# Altium schematic sheet Power_Neg.SchDoc
size A4; CompanyName: Technische Hochschule Nürnberg Georg Simon Ohm; Organization: UltraZohm; Address1: Kesslerplatz 12; Address2: 90489 Nürnberg; Address3: GERMANY; Website: www.ultrazohm.com
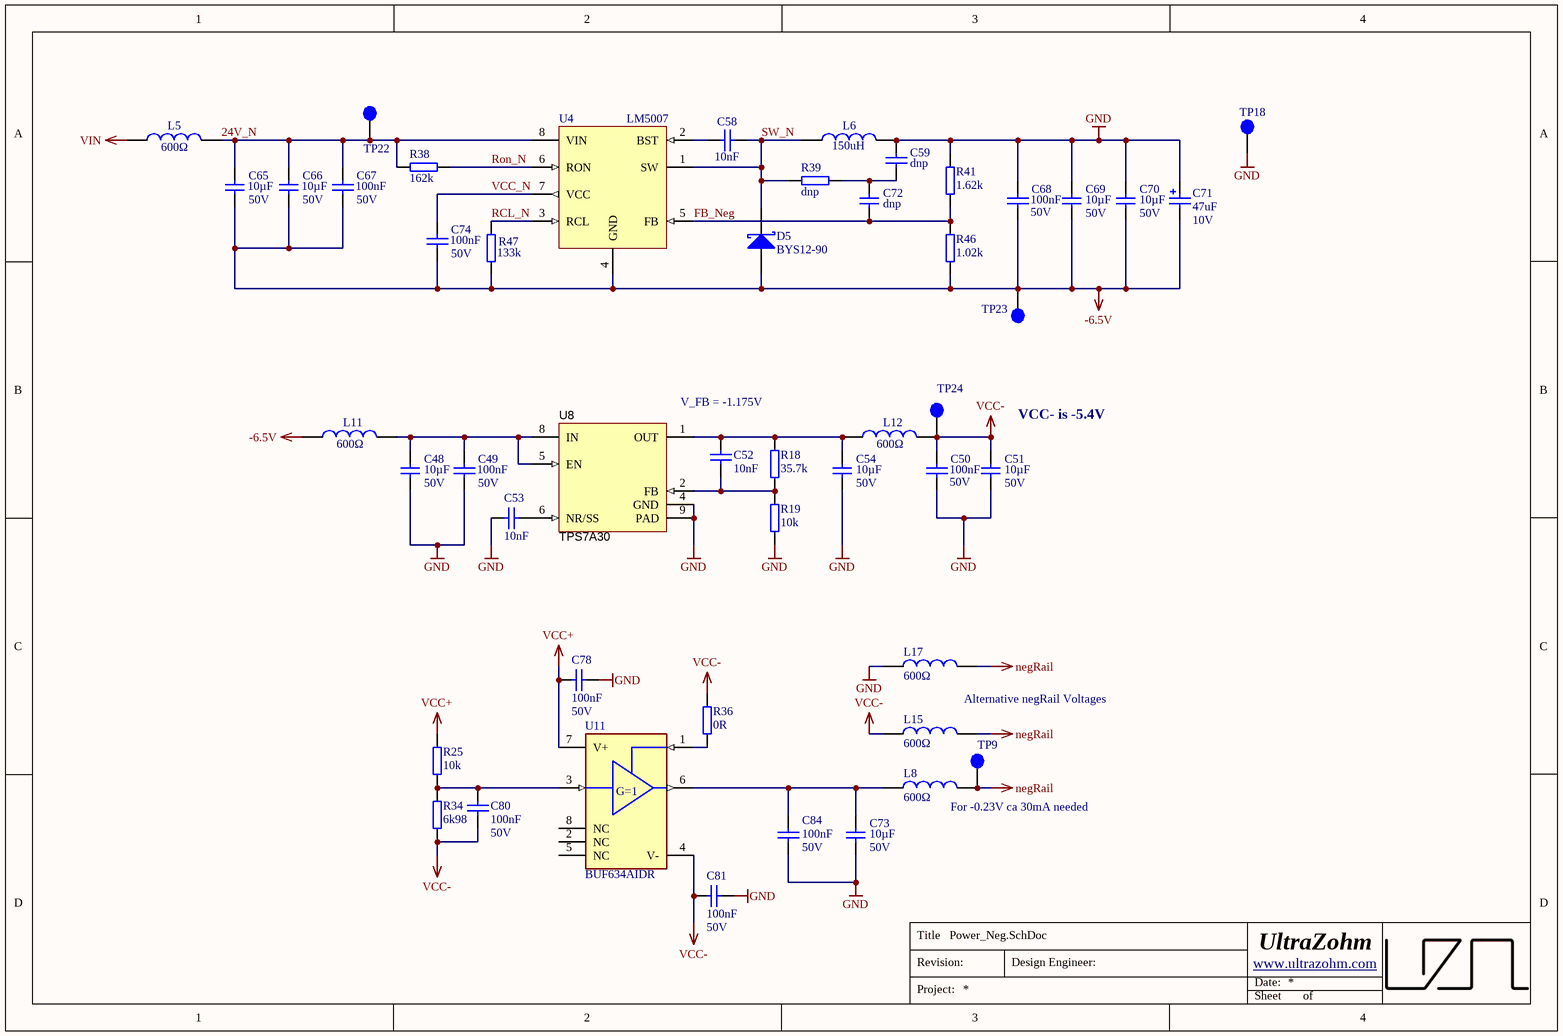
[diagram p0: Power_Neg.SchDoc]

## Parts
C48  10µF  Voltage: 50V  [C_1206]
C49  100nF  Voltage: 50V  [CAPC1608X07N]
C50  100nF  Voltage: 50V  [CAPC1608X07N]
C51  10µF  Voltage: 50V  [C_1206]
C52  10nF  [CAPC1608X07N]
C53  10nF  [CAPC1608X07N]
C54  10µF  Voltage: 50V  [C_1206]
C58  10nF  [CAPC1608X07N]
C59  dnp  [CAPC1608X07N]
C65  10µF  Voltage: 50V  [C_1206]
C66  10µF  Voltage: 50V  [C_1206]
C67  100nF  Voltage: 50V  [CAPC1608X07N]
C68  100nF  Voltage: 50V  [CAPC1608X07N]
C69  10µF  Voltage: 50V  [C_1206]
C70  10µF  Voltage: 50V  [C_1206]
C71  47uF  Voltage: 10V  [WCAP-ASLI_5x5.5]
C72  dnp  [C_1206]
C73  10µF  Voltage: 50V  [C_1206]
C74  100nF  Voltage: 50V  [CAPC1608X07N]
C78  100nF  Voltage: 50V  [CAPC1608X07N]
C80  100nF  Voltage: 50V  [CAPC1608X07N]
C81  100nF  Voltage: 50V  [CAPC1608X07N]
C84  100nF  Voltage: 50V  [CAPC1608X07N]
D5  BYS12-90  [DIOM4227X23N]
L5  600Ω  [WE-CBF_0805_High Current]
L6  150uH  [SMT_inductor_1050_Performance]
L8  600Ω  [WE-CBF_0805_High Current]
L11  600Ω  [WE-CBF_0805_High Current]
L12  600Ω  [WE-CBF_0805_High Current]
L15  600Ω  [WE-CBF_0805_High Current]
L17  600Ω  [WE-CBF_0805_High Current]
R18  35.7k  [RESC1608X06N]
R19  10k  [RESC1608X06N]
R25  10k  [RESC1608X06N]
R34  6k98  [RESC1608X06N]
R36  0R  [RESC1608X06N]
R38  162k  [RESC1608X06N]
R39  dnp  [RESC1608X06N]
R41  1.62k  [RESC1608X06N]
R46  1.02k  [RESC1608X06N]
R47  133k  [RESC1608X06N]
TP9  negRail  [TP_1mm]  (value not drawn)  (no BOM)
TP18  GND  [TP_1mm]  (value not drawn)  (no BOM)
TP22  VIN  [TP_1mm]  (value not drawn)  (no BOM)
TP23  -6.5V  [TP_1mm]  (value not drawn)  (no BOM)
TP24  VCC-  [TP_1mm]  (value not drawn)  (no BOM)
U4  LM5007  [TSOP65P490X110-8N]
U8  TPS7A30  [DGN0008D_N]
U11  BUF634AIDR  [FP-BUF634AIDR-MFG]

## Nets
-6.5V: C65.1 C66.1 C67.2 C68.1 C69.1 C70.1 C71.1(N) C74.2 D5.2(A) L11.1 R46.2 R47.1 TP23.1 U4.4(GND)
GND: C48.1 C49.2 C50.1 C51.1 C53.2 C54.1 C59.1 C68.2 C69.2 C70.2 C71.2(P) C73.1 C78.1 C81.1 C84.1 L6.2 L17.1 R19.2 R41.1 TP18.1 U8.4(GND) U8.9(PAD)
negRail: L8.2 L15.2 L17.2 TP9.1
VCC+: C78.2 R25.2 U11.7(V+)
VCC-: C50.2 C51.2 C80.2 C81.2 L12.2 L15.1 R34.1 R36.2 TP24.1 U11.4(V-)
VIN: L5.1
24V_N: C65.2 C66.2 C67.1 L5.2 R38.2 TP22.1 U4.8(VIN)
FB_Neg: C72.2 R41.2 R46.1 U4.5(FB)
RCL_N: R47.2 U4.3(RCL)
Ron_N: R38.1 U4.6(RON)
SW_N: C58.1 D5.1(K) L6.1 R39.2 U4.1(SW)
VCC_N: C74.1 U4.7(VCC)
NetC48_2: C48.2 C49.1 L11.2 U8.5(EN) U8.8(IN)
NetC52_1: C52.1 C54.2 L12.1 R18.1 U8.1(OUT)
NetC52_2: C52.2 R18.2 R19.1 U8.2(FB)
NetC53_1: C53.1 U8.6(NR/SS)
NetC58_2: C58.2 U4.2(BST)
NetC59_2: C59.2 C72.1 R39.1
NetC73_2: C73.2 C84.2 L8.1 U11.6(VO)
NetC80_1: C80.1 R25.1 R34.2 U11.3(VIN)
NetR36_1: R36.1 U11.1(BW)

Not connected (* = marked no-connect by the designer): U8 3(NC) 7(DNC); U11 2(NC) 5(NC) 8(NC)

## Notes on the sheet
- V_FB = -1.175V
- (near C51) VCC- is -5.4V
- Alternative negRail Voltages
- (near L8) For -0.23V ca 30mA needed
- Title
- Revision:
- Design Engineer:
- Date:
- Project:
- Sheet
- of
- (in symbol BUF634A) G=1

## Library data of the parts
C48 C51 C54 C69 C70 C73 = C_1206: Capacitor 1206; MPN: CL31A106MBHNNNE; Tolerance: 10%; MF: Samsung; Dielectric: X5R; Package: 1206; Value: 10µF; Created: 2020_09_17_Liegmann; Supplier 1: Mouser; Supplier Part Number 1: 187-CL31A106MBHNNNE
C49 C50 C67 C68 C74 = Cap_0603: MPN: CC0603KRX7R9BB104; MF: Yageo; Tolerance: 10%; Dielectric: X5R; Value: 100nF; Supplier 1: Mouser; Supplier 2: Mouser; Supplier Part Number 1: 603-CC603KRX7R9BB104; Supplier Part Number 2: 710-885382206004; Package: 0603
C52 C53 C58 = Cap_0603: MPN: 885012206065; MF: Würth Elektronik; Voltage: 25V; Dielectric: X7R; Value: 10nF; Supplier 1: Mouser; Supplier 2: Digi-Key; Supplier Part Number 1: 710-885012206065; Supplier Part Number 2: 732-7983-1-ND; Package: 0603
C59 = Cap_0603: MPN: C0603C752J3GACTU; possibleValue: 7.5nF; MF: KEMET; Voltage: 25V; Dielectric: C0G; Tolerance: 5%; Supplier 1: Mouser; Supplier 2: *; Supplier Part Number 1: 80-C0603C752J3GACTU; Supplier Part Number 2: *; Package: 0603; Value: dnp
C65 C66 = C_1206: Capacitor 1206; MPN: CL31A106MBHNNNE; Tolerance: 20%; MF: Samsung; Dielectric: X5R; Package: 1206; Value: 10µF; Supplier 1: Mouser; Supplier Part Number 1: 187-CL31A106MBHNNNE
C71 = 865080142007: WCAP-ASLI Aluminum Electrolytic Capacitor, V-Chip, SMT, D5xH5.5mm, 47uF, 10V; MPN: 865080242004; Dissipation Factor: 24%; Endurance: 2000h; Leakage Current: 6.3uA; MF: Wurth Elektronik; Ripple Current: 170mA; Capacitance Tolerance: +/-20%; Technical Reference: ASEC055101M6R3DVCTBB000; ComponentLink1Description: Manufacturer; ComponentLink1URL: http://www.we-online.de; ComponentLink2Description: Datasheet; ComponentLink2URL: https://www.we-online.com/catalog/datasheet/865080142007.pdf; Height: 5.5mm; Mounting Technology: SMT; Operating Temperature: -55 to +105degC; Packaging: Tape and Reel; Published Date: May 2020; Diameter: 5mm; Supplier 1: Mouser; Supplier Part Number 1: 710-865080242004; Value: 47uF
C72 = C_1206: Capacitor 1206; MPN: GRM3195C1H273JA01D; possibleValue: 0.027µF; Tolerance: 5%; MF: Murata Electronics; Dielectric: C0G; Voltage: 50V; Package: 1206; Supplier 1: Mouser; Supplier Part Number 1: 81-GRM315C1H273JA01D; Value: dnp
C78 C80 C81 C84 = Cap_0603: MPN: CC0603KRX7R9BB104; MF: Yageo; Dielectric: X5R; Value: 100nF; Supplier 1: Mouser; Supplier 2: Mouser; Supplier Part Number 1: 603-CC603KRX7R9BB104; Supplier Part Number 2: 710-885382206004; Package: 0603
D5 = BYS12-90: Schottky Diode; MPN: BYS12-90-E3/TR3; MF: Vishay; Forward Voltage: 750mV; Reverse Voltage: 90V; Rated Current: 1.5A; Package: DO-214AC; Supplier 1: Farnell; Supplier 2: Mouser; Supplier 3: Digi-Key; Supplier Part Number 1: 2889144; Supplier Part Number 2: 625-BYS12-90-E3/TR3; Supplier Part Number 3: BYS12-90-E3/GICT-ND; ComponentLink1Description: Manufacturer; ComponentLink1URL: https://www.vishay.com/; ComponentLink2Description: Datasheet; ComponentLink2URL: https://www.vishay.com/docs/88950/bys12-90.pdf
L5 L11 L12 = WE-CBF, 742792040: WE-CBF SMD EMI Suppression Ferrite Bead, 0805, 600Ω; MF: Würth Elektronik; Type: High Current; ComponentLink1Description: Manufacturer; ComponentLink1URL: http://www.we-online.de; ComponentLink2Description: Datasheet; ComponentLink2URL: http://katalog.we-online.de/pbs/datasheet/742792040.pdf; MPN: 742792040; Value: 600Ω; Size: 0805; Supplier 1: Farnell; Supplier 2: Mouser; Supplier 3: Digi-Key; Supplier Part Number 1: 1635735; Supplier Part Number 2: 710-742792040; Supplier Part Number 3: 732-1620-1-ND
L6 = B82464G4154M: SMT power Inductor, 150uH, 320m DRC; MF: EPCOS / TDK; Rated Current: 0.85 A; MPN: B82464G4154M; Supplier 1: Mouser; Supplier Part Number 1: 871-B82464G4154M; Value: 150uH; DCR: 320m; ComponentLink1Description: Manufacturer; ComponentLink1URL: https://www.tdk-electronics.tdk.com/de; ComponentLink2Description: Datasheet; ComponentLink2URL: https://www.tdk-electronics.tdk.com/inf/30/db/ind_2008/b82464g4.pdf
L8 L15 L17 = WE-CBF, 742792040: WE-CBF SMD EMI Suppression Ferrite Bead, 0805, 600Ω; MF: Wurth Elektronik; Type: High Current; PublishedDate: Aug 2016; ComponentLink1Description: Manufacturer; ComponentLink1URL: http://www.we-online.de; ComponentLink2Description: Datasheet; ComponentLink2URL: http://katalog.we-online.de/pbs/datasheet/742792040.pdf; MPN: 742792040; Value: 600Ω; Size: 0805; Supplier 1: Farnell; Supplier 2: Mouser; Supplier 3: Digi-Key; Supplier Part Number 1: 2761567; Supplier Part Number 2: 710-742792040; Supplier Part Number 3: 732-1620-1-ND
R18 = R_0603: MPN: CR0603-FX-3572ELF; MF: Bourns; Tolerance: 1%; Value: 35.7k; Supplier 1: Mouser; Supplier Part Number 1: 652-CR0603FX-3572ELF; Package: 0603
R19 R25 = R_0603: MPN: CR0603-FX-1002ELF; MF: Bourns; Tolerance: 1%; Value: 10k; Supplier 1: Mouser; Supplier Part Number 1: 652-CR0603FX-1002ELF; Package: 0603
R34 = R_0603: MPN: CR0603-FX-6981ELF; MF: Bourns; Tolerance: 1%; Value: 6k98; Supplier 1: Mouser; Supplier Part Number 1: 652-CR0603FX-6981ELF; Package: 0603
R36 = R_0603: MPN: CRCW06030000Z0EBC; MF: Vishay / Dale; Value: 0R; Supplier 1: Mouser; Supplier Part Number 1: 71-CRCW06030000Z0EBC; Package: 0603
R38 = R_0603: MPN: CR0603-FX-1623ELF; MF: Bourns; Value: 162k; Supplier 1: Mouser; Supplier Part Number 1: 652-CR0603-FX1623ELF; Package: 0603
R39 = R_0603: MPN: AC0603FR-1375KL; possibleValue: 75k; MF: Yageo; Supplier 1: Mouser; Supplier Part Number 1: 603-AC0603FR-1375KL; Package: 0603; Value: dnp
R41 = R_0603: MPN: CR0603-FX-1621ELF; MF: Bourns; Tolerance: 1%; Value: 1.62k; Supplier 1: Mouser; Supplier Part Number 1: 652-CR0603FX-1621ELF; Package: 0603
R46 = R_0603: MPN: CR0603-FX-1021ELF; MF: Bourns; Tolerance: 1%; Value: 1.02k; Supplier 1: Mouser; Supplier Part Number 1: 652-CR0603FX-1021ELF; Package: 0603
R47 = R_0603: MPN: CR0603-FX-1333ELF; MF: Bourns; Value: 133k; Supplier 1: Mouser; Supplier Part Number 1: 652-CR0603FX-1333ELF; Package: 0603
TP9 TP18 TP22-TP24 = TP_1mm: Testpoint 1mm; Created: 2018_06_25_AGeiger; Value: Testpoint 1mm
U4 = LM5007: Buck Converter, 9-75Vin, 2.5-73Vout; MPN: LM5007MM/NOPB; MF: Texas Instruments; Supplier 1: Farnell; Supplier 2: Mouser; Supplier 3: Digi-Key; Supplier Part Number 1: 9779345; Supplier Part Number 2: 926-LM5007MM/NOPB; Supplier Part Number 3: LM5007MM/NOPBCT-ND; Package: VSSOP-8; ComponentLink1Description: Manufacturer; ComponentLink1URL: https://www.ti.com/; ComponentLink2Description: Datasheet; ComponentLink2URL: https://www.ti.com/lit/ds/symlink/lm5007.pdf?ts=1616234834930&ref_url=https%253A%252F%252Fwww.google.ru%252F
U8 = TPS7A3001DGN: -36V, -200mA, Ultralow-Noise, High PSRR, Adjustable -1.18 to -33 V Output, Negative Linear Regulator, 8-pin MSOP (DGN), -40 to 125 degC, Green (RoHS & no Sb/Br); MF: Texas Instruments; Parameter 1: Farnell; PackageReference: DGN0008D; PackageDescription: 8-pin Plastic Small Outline, Body 3 x 3 mm, Pitch 0.65 mm; Supplier 1: Digi-Key; Supplier Part Number 1: 296-27750-1-ND; MPN: TPS7A3001DGN; ComponentLink1Description: Manufacturer URL; ComponentLink1URL: http://www.ti.com/; ComponentLink2Description: Datasheet; ComponentLink2URL: http://www.ti.com/general/docs/lit/getliterature.tsp?genericPartNumber=TPS7A3001&fileType=pdf; ComponentLink3Description: Package Specification; ComponentLink3URL: http://www.ti.com/litv/pdf/mpds046e; Supplier 2: Mouser; Supplier Part Number 2: 595-TPS7A3001DGNT; Supplier Part Number 3: 3122632
U11 = BUF634A: IC OP AMP BUFFER 8SOIC; Voltage Gain: 0.00099V/mV; Standoff Height: 0.11mm; Min Dual Supply Voltage: 2.25V; Gain Bandwidth: 240MHz; Output Current Per Channel: 250mA; Input Offset Voltage: 36mV; Min Supply Voltage: 4.5V; Number Of Channels: 1; Max Junction Temp: +150°C; Max Supply Voltage: 36V; Bandwidth: 35-210MHz; Input Bias Current: 0.03-0.25uA; Max Dual Supply Voltage: 18V; MF: Texas Instruments; Nominal Supply Current: 1.5-8.5mA; Height: 1.75mm; MPN: BUF634AIDR; Automotive: No; Digikey Description: IC OP AMP BUFFER 8SOIC; Device Class L3: Buffer; ComponentLink2URL: http://www.ti.com/lit/ds/symlink/buf634a.pdf; Category: IC; Device Class L2: Linear ICs; Device Class L1: Integrated Circuits (ICs); Temperature Range Low: -40°C; Package: SOIC8; Temperature: -40°C to +125°C; Temperature Range High: +125°C; Mouser Description: High-Speed Buffer 1 Channel 35MHz to 210MHz 36V 250mA Bipolar 8-Pin SOIC T/R; Octopart: https://octopart.com/buf634aidr-texas+instruments-99505311; RoHS: TRUE; Lead Free: Yes; ComponentLink2Description: Datasheet; Supplier 1: Mouser; Supplier Part Number 1: 595-BUF634AIDR